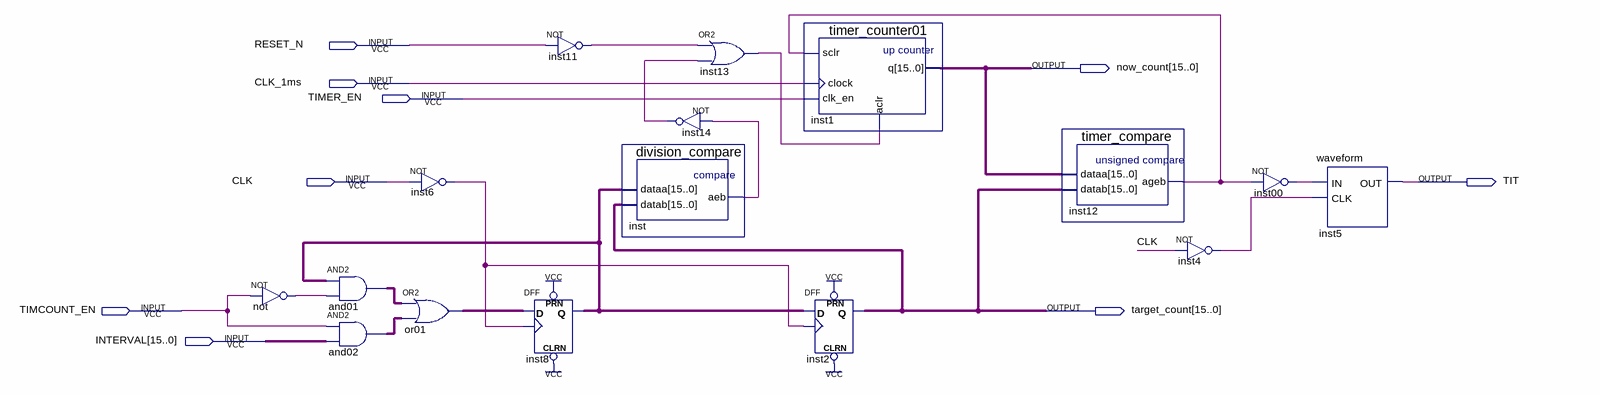
[diagram p0: schematic sheet]
// Quartus schematic sep5_cycle_timer.bdf as structural Verilog: 16 symbols, 9 pins
module sep5_cycle_timer (
  input  RESET_N,
  input  CLK_1ms,
  input  TIMER_EN,
  input  CLK,
  input  TIMCOUNT_EN,
  input  [15:0] INTERVAL,
  output [15:0] now_count,
  output TIT,
  output [15:0] target_count
);

  wire inst00_out, inst4_out, inst6_out, inst11_out, inst12_ageb, inst13_out, inst14_out, inst_aeb, not_out;
  wire [15:0] and01_out, and02_out, inst8_q, or01_out;

  not \not  (not_out, TIMCOUNT_EN);
  assign and01_out = inst8_q & {16{not_out}};  // AND2 and01, 16 bits wide
  assign and02_out = {16{TIMCOUNT_EN}} & INTERVAL;  // AND2 and02, 16 bits wide
  not inst6 (inst6_out, CLK);
  assign or01_out = and01_out | and02_out;  // OR2 or01, 16 bits wide
  not inst11 (inst11_out, RESET_N);
  DFF inst8[15:0] (.CLRN(1'b1), .CLK(inst6_out), .D(or01_out), .PRN(1'b1), .Q(inst8_q));
  division_compare inst (.dataa(inst8_q), .datab(target_count), .aeb(inst_aeb));
  or inst13 (inst13_out, inst11_out, inst14_out);
  not inst14 (inst14_out, inst_aeb);
  timer_counter01 inst1 (.sclr(inst12_ageb), .clock(CLK_1ms), .clk_en(TIMER_EN), .aclr(inst13_out), .q(now_count));
  DFF inst2[15:0] (.CLRN(1'b1), .CLK(inst6_out), .D(inst8_q), .PRN(1'b1), .Q(target_count));
  timer_compare inst12 (.dataa(now_count), .datab(target_count), .ageb(inst12_ageb));
  not inst4 (inst4_out, CLK);
  not inst00 (inst00_out, inst12_ageb);
  waveform inst5 (.IN(inst00_out), .CLK(inst4_out), .OUT(TIT));
endmodule
